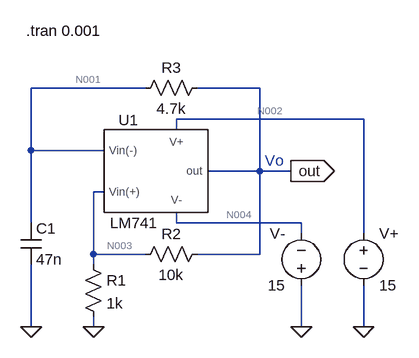
[diagram p0: schematic Schema_4-8.asc]
Schema_4-8.asc, the LTspice schematic file:
Version 4.1
SHEET 1 880 680
WIRE 240 -16 64 -16
WIRE 416 -16 320 -16
WIRE 576 32 288 32
WIRE 288 48 288 32
WIRE 64 80 64 -16
WIRE 176 80 64 80
WIRE 416 112 416 -16
WIRE 416 112 336 112
WIRE 464 112 416 112
WIRE 176 144 160 144
WIRE 64 192 64 80
WIRE 288 192 288 176
WIRE 480 192 288 192
WIRE 480 208 480 192
WIRE 576 208 576 32
WIRE 160 240 160 144
WIRE 240 240 160 240
WIRE 416 240 416 112
WIRE 416 240 320 240
WIRE 160 256 160 240
WIRE 64 352 64 256
WIRE 160 352 160 336
WIRE 480 352 480 288
WIRE 576 352 576 288
FLAG 160 352 0
FLAG 64 352 0
FLAG 480 352 0
FLAG 576 352 0
FLAG 464 112 out
IOPIN 464 112 Out
SYMBOL res 144 240 R0
SYMATTR InstName R1
SYMATTR Value 1k
SYMBOL res 336 224 R90
WINDOW 0 0 56 VBottom 2
WINDOW 3 32 56 VTop 2
SYMATTR InstName R2
SYMATTR Value 10k
SYMBOL res 336 -32 R90
WINDOW 0 0 56 VBottom 2
WINDOW 3 32 56 VTop 2
SYMATTR InstName R3
SYMATTR Value 4.7k
SYMBOL cap 48 192 R0
SYMATTR InstName C1
SYMATTR Value 47n
SYMBOL voltage 576 192 R0
SYMATTR InstName V+
SYMATTR Value 15
SYMBOL voltage 480 304 R180
WINDOW 0 24 96 Left 2
WINDOW 3 24 16 Left 2
SYMATTR InstName V-
SYMATTR Value 15
SYMBOL LM741 224 96 R0
SYMATTR InstName U1
TEXT 424 96 Left 2 ;Vo
TEXT 56 -104 Left 2 !.tran 0.001

The netlist it stands for:
* Schema_4-8.asc
R1 N003 0 1k
R2 out N003 10k
R3 out N001 4.7k
C1 N001 0 47n
V+ N002 0 15
V- 0 N004 15
X§U1 N003 N001 N002 N004 out LM741  ; pins Vin(+) Vin(-) V+ V- out
* Vo
.tran 0.001
.lib C:\users\kou\Documents\Electronics\Electronics_2\LM741\lm741.lib
.backanno
.end

* Results of the author's LTspice run, read from the files saved beside the schematic
* Operating Point, zero values left out:
*   V(out) = 1.569 mV
*   V(n002) = 15 V
*   V(n004) = -15 V
*   V(n003) = 90.02 µV
*   V(n001) = 1.09 mV
*   I(R3) = 101.9 nA
*   I(V+) = -1.701 mA
*   I(R1) = 90.02 nA
*   I(V-) = -1.701 mA
*   I(R2) = 147.9 nA
*   Ix(u1:1) = 57.86 nA
*   Ix(u1:2) = 101.9 nA
*   Ix(u1:99) = 1.701 mA
*   Ix(u1:50) = -1.701 mA
*   Ix(u1:28) = -249.7 nA
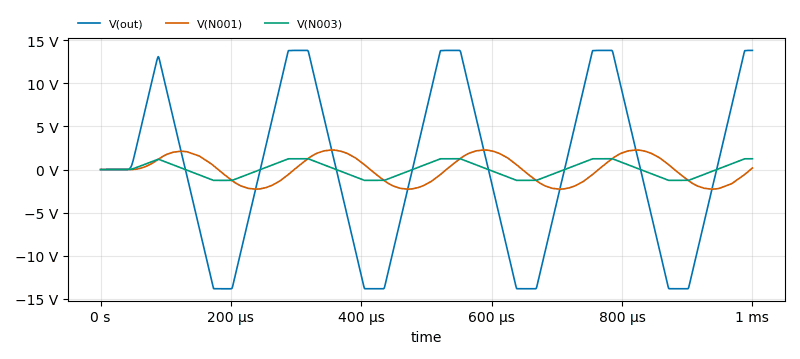
[diagram p1: Transient Analysis of Schema_4-8.asc, plotted from the saved traces]
* Transient Analysis, 1 run:
*   V(out): min -13.83 V, max 13.83 V, average 28.2 mV, rms 9.477 V, last 13.82 V
*   V(N001): min -2.269 V, max 2.27 V, average -11.31 mV, rms 1.558 V, last 180 mV
*   V(N003): min -1.257 V, max 1.257 V, average 2.482 mV, rms 860.5 mV, last 1.254 V